# EAGLE schematic breakout proto-checkup (EAGLE 9.0.0)
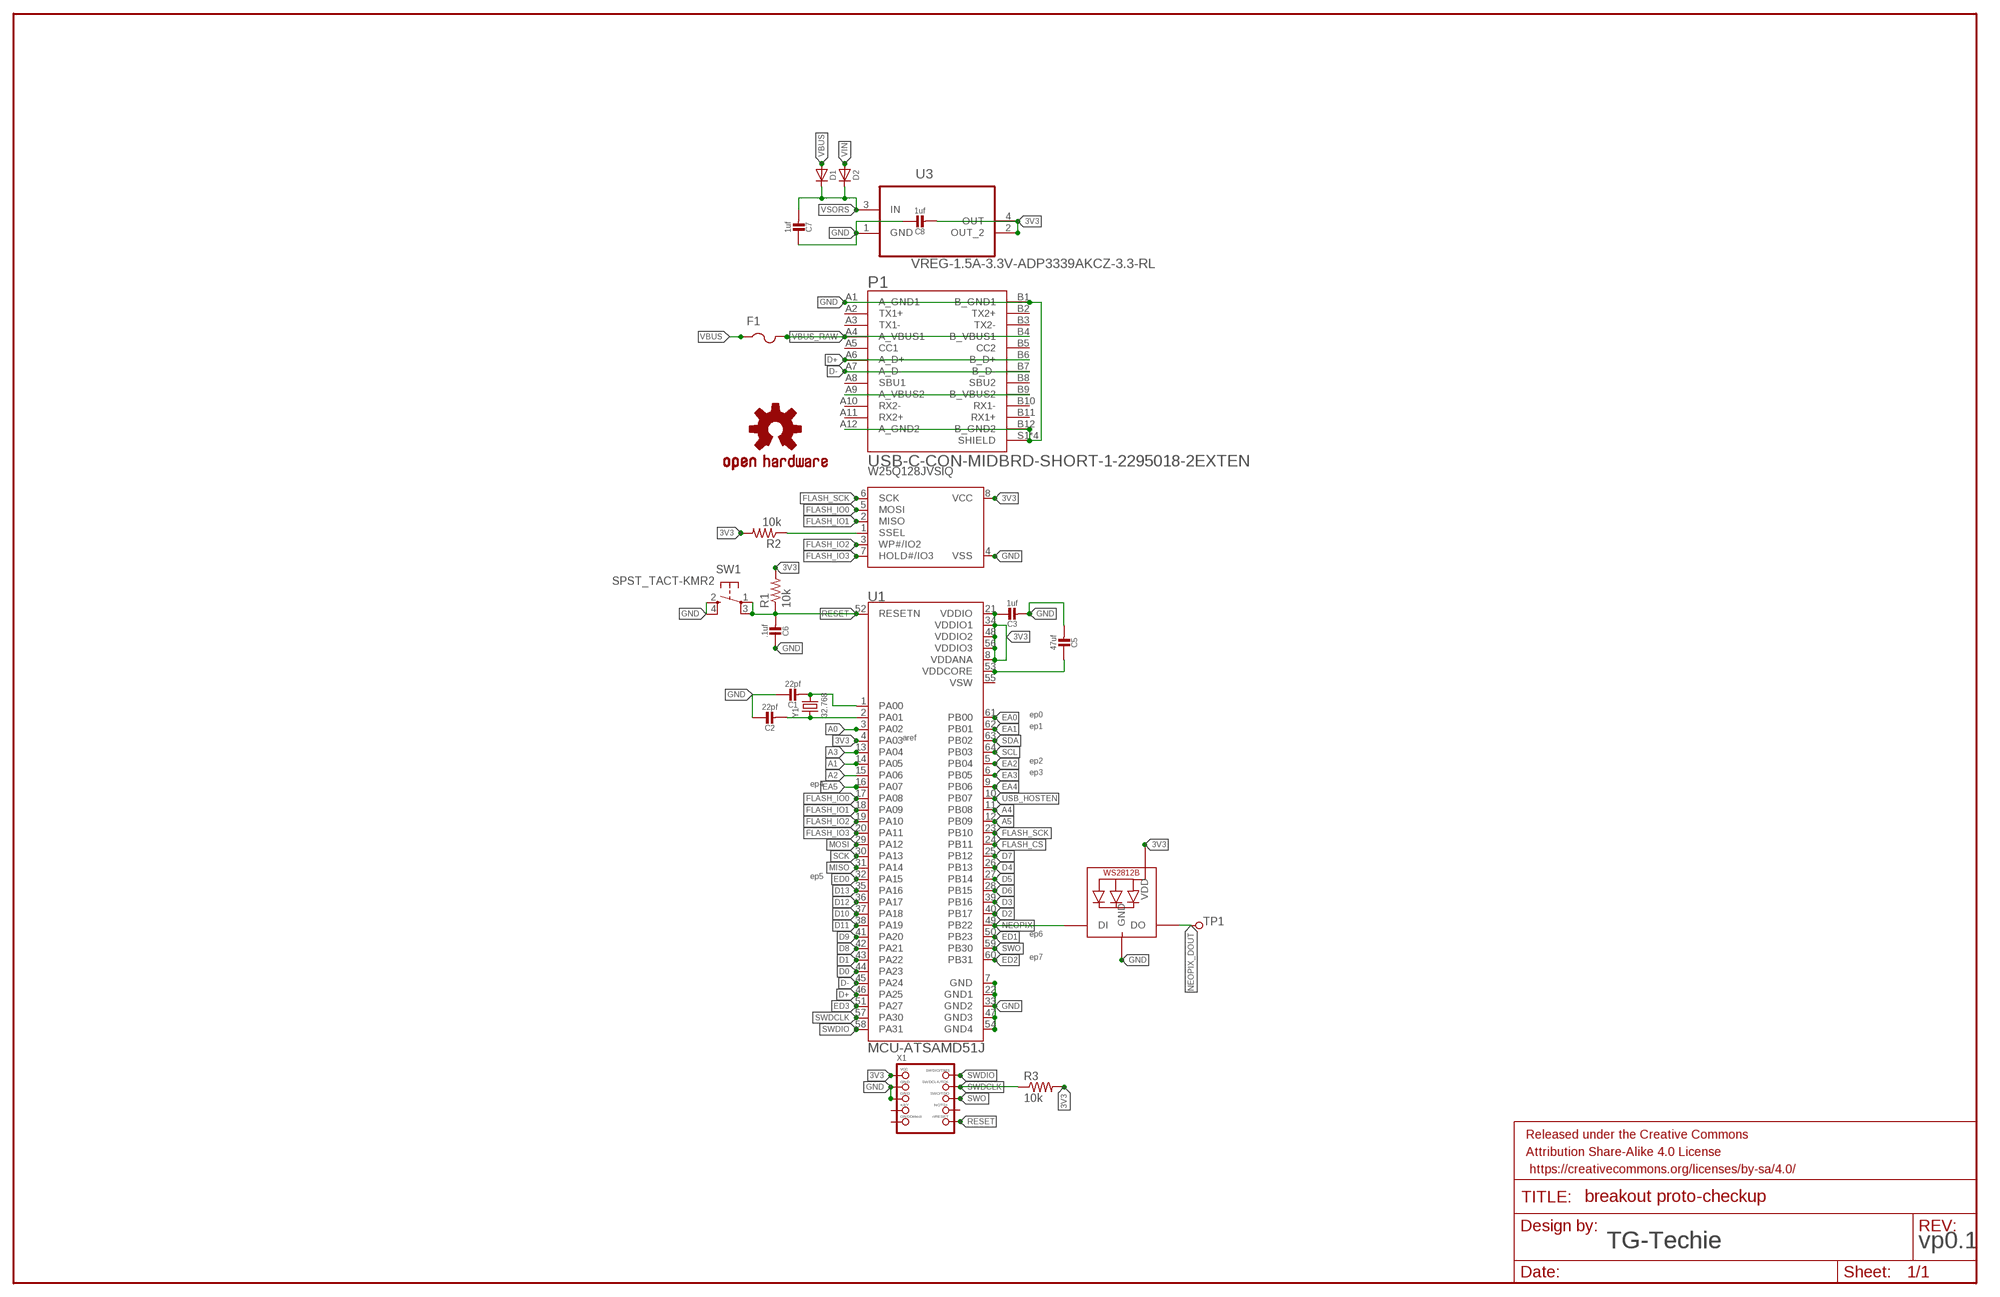
[diagram p0: schematic, sheet 1]

## Parts
C1  22pf  C-US__0805  [MICROBUILDER__0805]
C2  22pf  C-US__0805  [MICROBUILDER__0805]
C3  1uf  C-US__0805  [MICROBUILDER__0805]
C5  47uf  C-US__0805  [MICROBUILDER__0805]
C6  .1uf  C-US__0805  [MICROBUILDER__0805]
C7  1uf  C-US__0805  [MICROBUILDER__0805]
C8  1uf  C-US__0805  [MICROBUILDER__0805]
D1  DIODESOD-123  [SOD-123]
D2  DIODESOD-123  [SOD-123]
F1  PTCFUSE-1206  [R1206]
FRAME1  FRAME-LEDGER  [CREATIVE_COMMONS]
LED1  LED-NEO-WS2812B3535  [LED3535]
LOGO1  OSHW-LOGOMINI  [OSHW-LOGO-MINI]
P1  USB-C-CON-MIDBRD-SHORT-1-2295018-2EXTEN  [TE_1-2295018-2_EXTEN]
R1  10k  R-US_R0805  [R0805]
R2  10k  R-US_R0805  [R0805]
R3  10k  R-US_R0805  [R0805]
SW1  SPST_TACT-KMR2  [KMR2]
TP1  TESTPOINT_1X1  [1X1_POGO]
U1  MCU-ATSAMD51J  [QFP50P1200X1200X120-64N]
U3  VREG-1.5A-3.3V-ADP3339AKCZ-3.3-RL  [SOT230P700X180-4N]
W25Q128JVSIQ  FLASH-SPI-SOIC8208MIL  [SOIC8_208MIL]
X1  INTRFC-JTAG-CORTEXBOXPOSTS  [2X05_1.27MM_BOX_POSTS]
Y1  32.768  XTAL_ADA4.9X1.8  [MICROBUILDER_CRYSTAL_4.9X1.8]

## Nets
3V3: C3.1 C8.2 LED1.2(VDD) R1.2 R2.2 R3.2 U1.4(PA03) U1.8(VDDANA) U1.21(VDDIO) U1.34(VDDIO1) U1.48(VDDIO2) U1.56(VDDIO3) U3.2(OUT_2) U3.4(OUT) W25Q128JVSIQ.8(VCC) X1.1(VCC)
A0: U1.3(PA02)
A1: U1.14(PA05)
A2: U1.15(PA06)
A3: U1.13(PA04)
A4: U1.11(PB08)
A5: U1.12(PB09)
D0: U1.44(PA23)
D1: U1.43(PA22)
D2: U1.40(PB17)
D3: U1.39(PB16)
D4: U1.26(PB13)
D5: U1.27(PB14)
D6: U1.28(PB15)
D7: U1.25(PB12)
D8: U1.42(PA21)
D9: U1.41(PA20)
D10: U1.37(PA18)
D11: U1.38(PA19)
D12: U1.36(PA17)
D13: U1.35(PA16)
D+: P1.A6(A_D+) P1.B6(B_D+) U1.46(PA25)
D-: P1.A7(A_D-) P1.B7(B_D-) U1.45(PA24)
DAFDSFGASFG: R2.1 W25Q128JVSIQ.1(SSEL)
EA0: U1.61(PB00)
EA1: U1.62(PB01)
EA2: U1.5(PB04)
EA3: U1.6(PB05)
EA4: U1.9(PB06)
EA5: U1.16(PA07)
ED0: U1.32(PA15)
ED1: U1.50(PB23)
ED2: U1.60(PB31)
ED3: U1.51(PA27)
FLASH_CS: U1.24(PB11)
FLASH_IO0: U1.17(PA08) W25Q128JVSIQ.5(MOSI)
FLASH_IO1: U1.18(PA09) W25Q128JVSIQ.2(MISO)
FLASH_IO2: U1.19(PA10) W25Q128JVSIQ.3(WP#/IO2)
FLASH_IO3: U1.20(PA11) W25Q128JVSIQ.7(HOLD#/IO3)
FLASH_SCK: U1.23(PB10) W25Q128JVSIQ.6(SCK)
GND: C1.1 C2.1 C3.2 C5.2 C6.1 C7.1 C8.1 LED1.4(GND) P1.A1(A_GND1) P1.A12(A_GND2) P1.B1(B_GND1) P1.B12(B_GND2) P1.S1(SHIELD) P1.S2(SHIELD) P1.S3(SHIELD) P1.S4(SHIELD) SW1.2(S) SW1.4(S1) U1.7(GND) U1.22(GND1) U1.33(GND2) U1.47(GND3) U1.54(GND4) U3.1(GND) W25Q128JVSIQ.4(VSS) X1.3(GND) X1.5(GND)
MISO: U1.31(PA14)
MOSI: U1.29(PA12)
N$4: C5.1 U1.53(VDDCORE)
N$6: P1.A9(A_VBUS2) P1.B9(B_VBUS2)
N$32: C1.2 U1.1(PA00) Y1.2
N$33: C2.2 U1.2(PA01) Y1.1
NEOPIX: LED1.1(DI) U1.49(PB22)
NEOPIX_DOUT: LED1.3(DO) TP1.1
RESET: C6.2 R1.1 SW1.1(P) SW1.3(P1) U1.52(RESETN) X1.10(NRESET)
SCK: U1.30(PA13)
SCL: U1.64(PB03)
SDA: U1.63(PB02)
SWDCLK: R3.1 U1.57(PA30) X1.4(SWDCLK)
SWDIO: U1.58(PA31) X1.2(SWDIO)
SWO: U1.59(PB30) X1.6(SWO)
USB_HOSTEN: U1.10(PB07)
VBUS: D1.A F1.1
VBUS_RAW: F1.2 P1.A4(A_VBUS1) P1.B4(B_VBUS1)
VIN: D2.A
VSORS: C7.2 D1.C D2.C U3.3(IN)
Unconnected: P1.A2(TX1+) P1.A3(TX1-) P1.A5(CC1) P1.A8(SBU1) P1.A10(RX2-) P1.A11(RX2+) P1.B2(TX2+) P1.B3(TX2-) P1.B5(CC2) P1.B8(SBU2) P1.B10(RX1-) P1.B11(RX1+) X1.7(KEY) X1.8(TDI) X1.9(GNDDETECT)

## Notes on the sheet
- ep0
- ep1
- aref
- ep2
- ep3
- ep4
- ep5
- ep6
- ep7
- TG-Techie | TG-Techie | vp0.1

## Power pins joined to a net without a drawn wire
VSW: U1.55(VSW)

## Library data of the parts
C1-C3 C5-C8 = 0TG-Lib v01.3:C-US_: from: microbuilder Ceramic Capacitors For new designs, use the packages preceded by an '_' character since they are more reliable: The following footprints should be used on most boards: _0402 - Standard footprint for regular board layouts _0603 - Standard footprint for regular board layouts _0805 - Standard footprint for regular board layouts _1206 - Standard footprint for regular board layouts For extremely tight-pitch boards where space is at a premium, the following 'micro-pitch' footprints can be used (smaller pads, no silkscreen outline, etc.): _0402MP - Micro-pitch footprint for very dense/compact boards _0603MP - Micro-pitch footprint for very dense/compact boards _0805MP - Micro-pitch footprint for very dense/compact boards _1206MP - Micro-pitch footprint for very dense/compact boards
D1 D2 = 0TG-Lib v01.3:DIODE: Diode from: adafruit SMA Model Volts Amps Type Vf Ir Digikey # Notes SSA34-E3 40V 3A Schottky 480mV @ 3A 200uA @ 40V SSA34-E3/61TGITR-ND CDBA120-G 20V 1A Schottky 500mV @ 1A 500uA @ 20V 641-1014-6-ND REEL MBRA210 10V 2A Schottky 350mV @ 2A 700uA @ 10V MBRA210LT3 SOD-123 Model Volts Amps Type Vf Ir Order # Notes BAT54T1G 30V 200mA Schottky 800mV @ 200mA 2uA @ 25V BAT54T1GOSTR-ND B0530W 30V 500mA Schottky 430mV @ 500mA 130uA @ 30V B0530W-FDICT-ND REEL MBR120 20V 1A Schottky 340mV @ 1A MBR120VLSFT1GOSCT-ND SOD-323 Model Volts Amps Type Vf Ir Order # Notes PMEG2005EJ 20V 500mA Schottky 355mV @ 500mA 568-4110-1-ND ZLLS410 10V 570mA Schottky 380mV @ 570mA ZLLS410CT-ND 1N4148WS 75V 150mA Silicon/Simple 1V 1N4148WSFSCT-ND REEL SOD-523 Model Volts Amps Type Vf Ir Order # Notes BAT54XV2 30V 200mA Schottky 0.8V @ 100mA BAT54XV2CT-ND TB751S 30V 30mA Schottky RB751S-40TE61CT-ND SOT23-R/W (R = Solder Paste/Reflow Ovens, W = Hand-Soldering) Model Volts Amps Type Vf Ir Order # Notes BAT54FILM 40V 300mA Schottky 497-7162-1-ND POWERDI-5 Model Volts Amps Type Vf Ir Order # Notes PDS560 60V 5A Schottky 670mV @ 5A 150uA @ 60V PDS560DICT-ND
F1 = 00adafruit:PTCFUSE: PTC fuses, resettable thermistors
FRAME1 = SparkFun-Aesthetics:FRAME-LEDGER: Schematic Frame - Ledger Standard 11x14 US Ledger frame
LED1 = 0TG-Lib v01.3:LED-NEO-WS2812B: from: adafruit
LOGO1 = SparkFun-Aesthetics:OSHW-LOGO: Open-Source Hardware (OSHW) Logo This logo indicates the piece of hardware it is found on incorporates a OSHW license and/or adheres to the definition of open source hardware found here: http://freedomdefined.org/OSHW
P1 = 0TG-Lib v01.3:USB-C-CON-MIDBRD-SHORT-1-2295018-2: from: snapeda Conn USB Type C RCP 12 POS Solder RA SMD 12 Terminal 1 Port T/R
R1-R3 = 0TG-Lib v01.3:R-US_: from: eaglecad RESISTOR, American symbol; SPICEPREFIX: R
SW1 = 00adafruit:SPST_TACT: SMT 6mm switch, EVQQ2 series http://www.ladyada.net/library/eagle
TP1 = 0TG-Lib v01.3:TESTPOINT_1X1
U1 = 0TG-Lib v01.3:MCU-ATSAMD51J: 120MHZ 1024KB Flash 64 TQFP PKG inTray 85CTemp, 64 TQFP 10x10x1mm TRAY; AVAILABILITY: Good; DESCRIPTION: 120MHZ 1024KB Flash 64 TQFP PKG inTray 85CTemp, 64 TQFP 10x10x1mm TRAY; MF: Microchip; MP: ATSAMD51J20A-AU; PACKAGE: TQFP-64 Microchip; PRICE: 4.66 USD
U3 = 0TG-Lib v01.3:VREG-1.5A-3.3V-ADP3339AKCZ-3.3-RL: from: snapeda Low Dropout Regulator; AVAILABILITY: Good; DESCRIPTION: IC REG LINEAR 3.3V 1.5A SOT223-3; MF: Analog Devices; MP: ADP3339AKCZ-3.3-RL; PACKAGE: SOT-223-3 Analog Devices; PRICE: 3.52 USD
W25Q128JVSIQ = 0TG-Lib v01.3:FLASH-SPI-SOIC8: SOIC8 SPI Flash Be careful with the size since SOIC8 flash comes in several 'widths' SOIC8 150 mil M25P16 - 16Mbit (2Mbit x 8) Serial Flash (75MHz SPI Bus), Supply: 2.7-3.6V Digikey: SOIC8 - M25P16-VMN6P-ND SOIC8 208 mil W25Q16BVSSIG - 16Mbit (2Mbit x 8) Serial Flash (104MHz SPI Bus), Supply: 2.7-3.6V Digikey: SOIC8 - W25Q16BVSSIG-ND from: adafruit availability low
X1 = 0TG-Lib v01.3:INTRFC-JTAG-CORTEX: from: adafruit Serial Wire (SW-DP) Connector Standard 0.05" 10-pin connector is for use with the Cortex M and Cortex A SWD (serial wire debugger) interface (SW-DP) Connectors 2x05_1.27MM_SMT - Inexpensive surface-mount header with bare pins, compatible with standard 10-pin SWD cables (4UCON: 16846) 2x05_1.27MM_BOX_NOPOSTS - Polarised surface-mount box (4UCON with caps: 19735, without caps: 15117 2x05_1.27MM_BOX_POSTS - Polarised surface-mount box with mounting holes (4UCON: 20317) Pinout: http://infocenter.arm.com/help/topic/com.arm.doc.faqs/attached/13634/cortex_debug_connectors.pdf http://www.keil.com/peripherals/coresight/connectors.asp
Y1 = 0TG-Lib v01.3:XTAL_ADA: Crystals HC49UP - Surface Mount Crystal 4.0MHz 18pF +/-30ppm Surface Mount Crystal [Digikey: 535-9857-1-ND] 12.0 MHz Surface Mount Crystal [Digikey: 535-9869-6-ND] 25.0 MHz Surface Mount Crystal [Digikey: 535-9078-1-ND] 2.5 x 2.0mm - MEMs SMT Crystal 16.0 MHz 10pF 20ppm 2.5 x 2.0mm Crystal [Digikey -40-85°C: 535-10923-1-ND] 3.2 x 2.5mm - MEMs SMT Crystal 12.0 MHz 8pF 15ppm 3.2 x 2.5mm Crystal [Digikey: -10-70°C: 644-1047-1-ND -40-125°C: 644-1128-1-ND] 16.0 MHz 8pF 15ppm 3.2 x 2.5mm Crystal [Digikey: -10-70°C: 644-1049-1-ND -40-125°C: 644-1129-2-ND] 16.0 MHz 10pF 10ppm 3.2 x 2.5mm Crystal [Digikey: 644-1100-1-ND] 27.12 MHz 18pF 30ppm 3.2 x 2.5mm Crystal [Digikey: 887-1424-1-ND] 27.12MHz 10pF 10ppm 3.2 x 2.5mm Crystal [Digikey: 887-1329-1-ND] 4.9 x 1.8mm - MEMs SMT Crystal 32.768 KHz 12.5pF 20ppm 4.9 x 1.8mm Crystal [Digikey: SE2415CT-ND] 8.0 x 3.8mm - Surface Mount Crystal 32.768kHz 12.5pF 20ppm -40°C-85°C [Digikey: 535-9166-2-ND] Cylinder 32.768KHz Cylinder Crystal (2x6mm body) [Ex. Digikey: 300-8341-2-ND]